# Altium schematic sheet Max3232.SchDoc
size A4
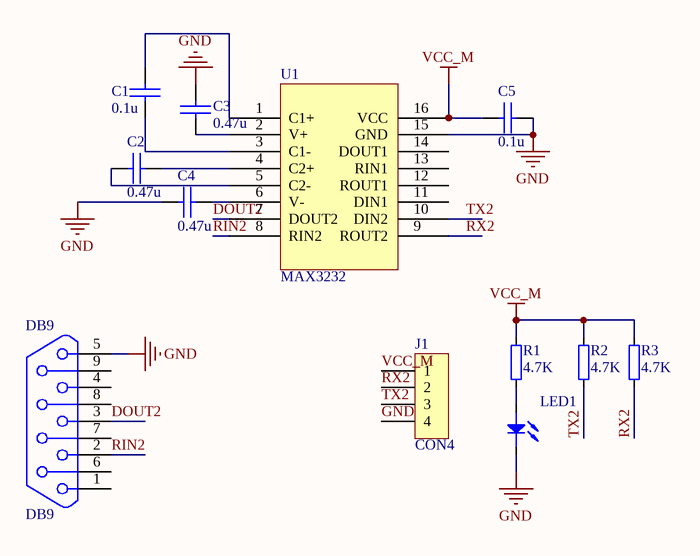
[diagram p0: Max3232.SchDoc]

## Parts
C1  0.1u  [C0603]
C2  0.47u  [C0603]
C3  0.47u  [C0603]
C4  0.47u  [C0603]
C5  0.1u  [C0603]
DB9  DB9  [DB9]
J1  CON4  [HDR1X4]
LED1  (no value)  [LED0805]
R1  4.7K  [R0603]
R2  4.7K  [R0603]
R3  4.7K  [R0603]
U1  MAX3232  [SSOP-16-SP3232]

## Nets
GND: C3.2 C4.1 C5.2 DB9.5 J1.4 LED1.2 U1.15(GND)
VCC_M: C5.1 J1.1 R1.2 R2.2 R3.2 U1.16(VCC)
DOUT2: DB9.3 U1.7(DOUT2)
RIN2: DB9.2 U1.8(RIN2)
RX2: J1.2 R3.1 U1.9(ROUT2)
TX2: J1.3 R2.1 U1.10(DIN2)
NetC1_1: C1.1 U1.3(C1-)
NetC1_2: C1.2 U1.1(C1+)
NetC2_1: C2.1 U1.5(C2-)
NetC2_2: C2.2 U1.4(C2+)
NetC3_1: C3.1 U1.2(V+)
NetC4_2: C4.2 U1.6(V-)
NetLED1_1: LED1.1 R1.1

Not connected (* = marked no-connect by the designer): DB9 1 4 6 7 8 9; U1 11(DIN1) 12(ROUT1) 13(RIN1) 14(DOUT1)

## Library data of the parts
C1-C5 = CAP: Part Field 1: CAP X7R 100NF 10% 50V 0805; Part Field 2: AAPL; Part Field 3: 8124-10446-12
J1 = CON4: Connector
LED1 = LED
R1 = res
R2 R3 = RES